# Altium schematic sheet IF.SchDoc: Ararinha 6F
size A4; Revision: 2.0; SheetNumber: 2; SheetTotal: 7
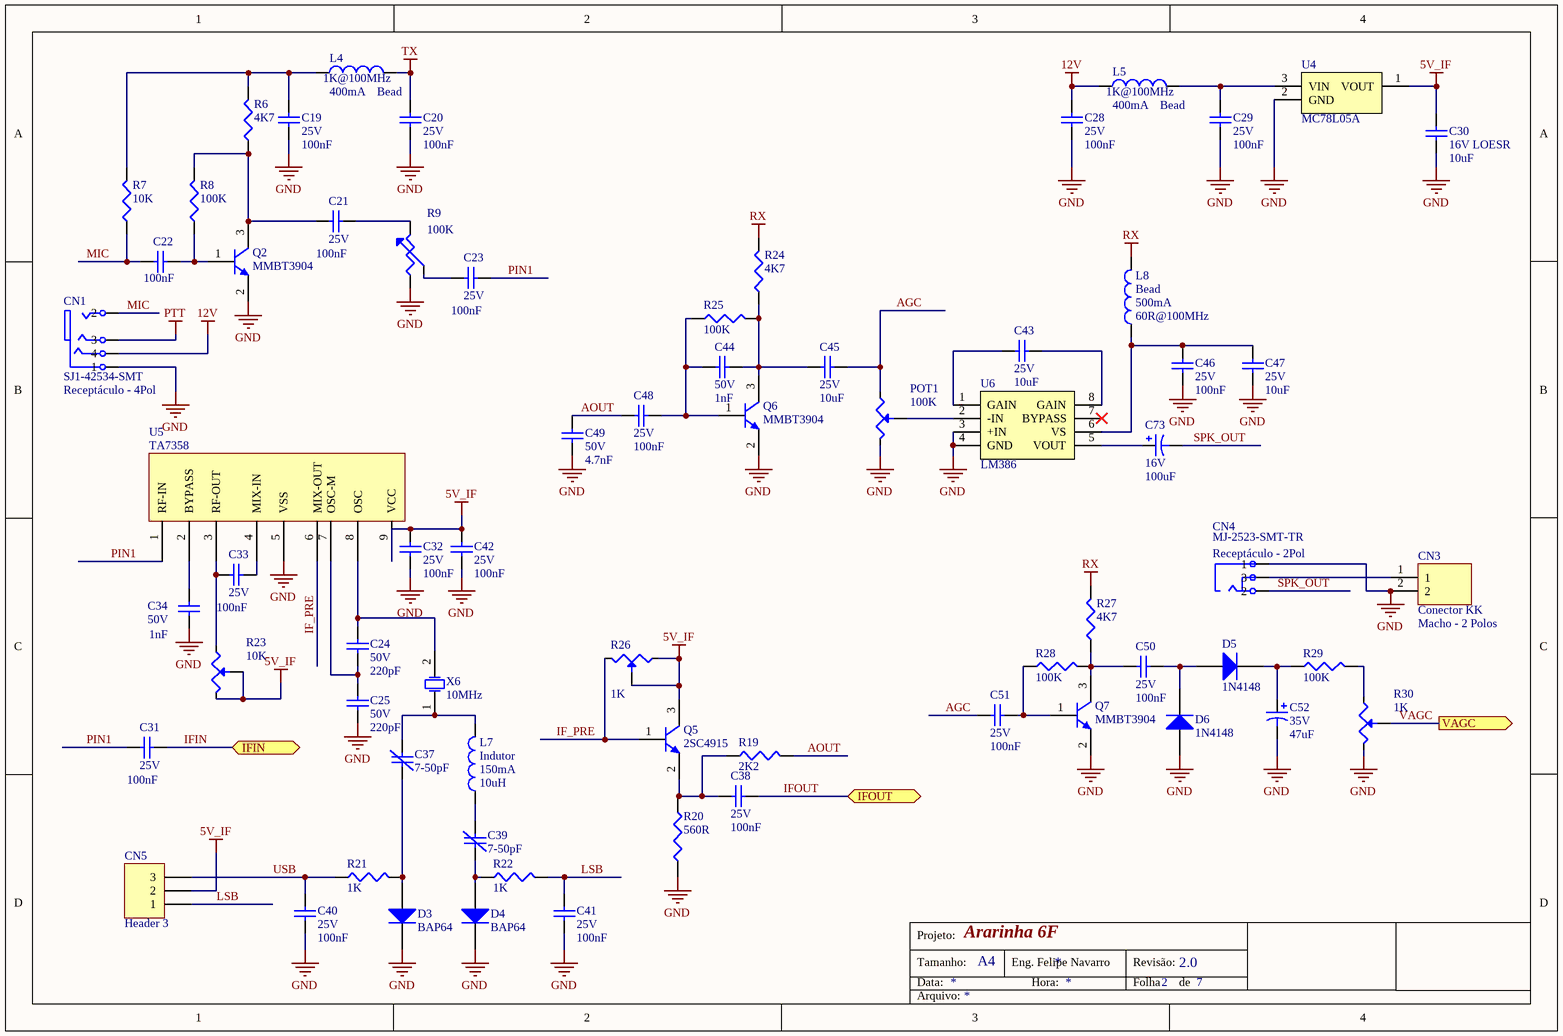
[diagram p0: IF.SchDoc]

## Parts
C19  value 100nF  Tensão: 25V  [CC0603]  (hidden comment: Capacitor Cerâmico)
C20  value 100nF  Tensão: 25V  [CC0603]  (hidden comment: Capacitor Cerâmico)
C21  value 100nF  Tensão: 25V  [CC0603]  (hidden comment: Capacitor Cerâmico)
C22  value 100nF  [CC0603]  (hidden comment: Capacitor Cerâmico)
C23  value 100nF  Tensão: 25V  [CC0603]  (hidden comment: Capacitor Cerâmico)
C24  value 220pF  Tensão: 50V  [CC0603]  (hidden comment: Capacitor Cerâmico)
C25  value 220pF  Tensão: 50V  [CC0603]  (hidden comment: Capacitor Cerâmico)
C28  value 100nF  Tensão: 25V  [CC0603]  (hidden comment: Capacitor Cerâmico)
C29  value 100nF  Tensão: 25V  [CC0603]  (hidden comment: Capacitor Cerâmico)
C30  value 10uF  Tensão: 16V LOESR  [CC0805]  (hidden comment: Capacitor Cerâmico)
C31  value 100nF  Tensão: 25V  [CC0603]  (hidden comment: Capacitor Cerâmico)
C32  value 100nF  Tensão: 25V  [CC0603]  (hidden comment: Capacitor Cerâmico)
C33  value 100nF  Tensão: 25V  [CC0603]  (hidden comment: Capacitor Cerâmico)
C34  value 1nF  Tensão: 50V  [CC0603]  (hidden comment: Capacitor Cerâmico)
C37  value 7-50pF  [MURATA TZB4]  (hidden comment: Trimmer)
C38  value 100nF  Tensão: 25V  [CC0603]  (hidden comment: Capacitor Cerâmico)
C39  value 7-50pF  [MURATA TZB4]  (hidden comment: Trimmer)
C40  value 100nF  Tensão: 25V  [CC0603]  (hidden comment: Capacitor Cerâmico)
C41  value 100nF  Tensão: 25V  [CC0603]  (hidden comment: Capacitor Cerâmico)
C42  value 100nF  Tensão: 25V  [CC0603]  (hidden comment: Capacitor Cerâmico)
C43  value 10uF  Tensão: 25V  [CC0805]  (hidden comment: Capacitor Cerâmico)
C44  value 1nF  Tensão: 50V  [CC0603]  (hidden comment: Capacitor Cerâmico)
C45  value 10uF  Tensão: 25V  [CC0805]  (hidden comment: Capacitor Cerâmico)
C46  value 100nF  Tensão: 25V  [CC0603]  (hidden comment: Capacitor Cerâmico)
C47  value 10uF  Tensão: 25V  [CC0805]  (hidden comment: Capacitor Cerâmico)
C48  value 100nF  Tensão: 25V  [CC0603]  (hidden comment: Capacitor Cerâmico)
C49  value 4.7nF  Tensão: 50V  [CC0603]  (hidden comment: Capacitor Cerâmico)
C50  value 100nF  Tensão: 25V  [CC0603]  (hidden comment: Capacitor Cerâmico)
C51  value 100nF  Tensão: 25V  [CC0603]  (hidden comment: Capacitor Cerâmico)
C52  value 47uF  Tensão: 35V  [CPOLRAD5X11]  (hidden comment: Capacitor Eletrolítico)
C73  value 100uF  Tensão: 16V  [CPOLRAD6X12]  (hidden comment: Capacitor Eletrolítico)
CN1  SJ1-42534-SMT  value Receptáculo - 4Pol  [CONN_JACK-P2_2.5-4N]
CN3  Conector KK  value Macho - 2 Polos  [CONN HDR2-POL P.100]
CN4  MJ-2523-SMT-TR  value Receptáculo - 2Pol  [MJ-2523-SMT-TR]
CN5  Header 3  [CONN HDR1X3]
D3  BAP64  [SOD523]
D4  BAP64  [SOD523]
D5  1N4148  [SOD-323 Diodo-K2]
D6  1N4148  [SOD-323 Diodo-K2]
L4  Bead  value 1K@100MHz  Corrente: 400mA  [CC0603]
L5  Bead  value 1K@100MHz  Corrente: 400mA  [CC0603]
L7  Indutor  value 10uH  Corrente: 150mA  [CC0805]
L8  Bead  value 60R@100MHz  Corrente: 500mA  [CC0603]
POT1  value 100K  [POT - PTV09]  (hidden comment: Potenciômetro)
Q2  MMBT3904  [SOT-23-3N]
Q5  2SC4915  [SOT-23-3N]
Q6  MMBT3904  [SOT-23-3N]
Q7  MMBT3904  [SOT-23-3N]
R6  value 4K7  [CC0603]  (hidden comment: Resistor)
R7  value 10K  [CC0603]  (hidden comment: Resistor)
R8  value 100K  [CC0603]  (hidden comment: Resistor)
R9  value 100K  [POT]  (hidden comment: Potenciômetro)
R19  value 2K2  [CC0603]  (hidden comment: Resistor)
R20  value 560R  [CC0603]  (hidden comment: Resistor)
R21  value 1K  [CC0603]  (hidden comment: Resistor)
R22  value 1K  [CC0603]  (hidden comment: Resistor)
R23  value 10K  [POT]  (hidden comment: Potenciômetro)
R24  value 4K7  [CC0603]  (hidden comment: Resistor)
R25  value 100K  [CC0603]  (hidden comment: Resistor)
R26  value 1K  [POT]  (hidden comment: Potenciômetro)
R27  value 4K7  [CC0603]  (hidden comment: Resistor)
R28  value 100K  [CC0603]  (hidden comment: Resistor)
R29  value 100K  [CC0603]  (hidden comment: Resistor)
R30  value 1K  [POT]  (hidden comment: Potenciômetro)
U4  MC78L05A  [SOT-89-3N]
U5  TA7358  [SIP9]
U6  LM386  [SOIC-8N]
X6  10MHz  [HC/49US]

## Ports
IFIN (bidir), IFOUT (bidir), VAGC (out)

## Nets
5V_IF: C30.2 C32.1 C42.1 CN5.2 Q5.3(C) R23.2(TAP) R23.3 R26.1 R26.2(TAP) U4.1(VOUT) U5.9(VCC)
12V: C28.1 CN1.4 L5.1
GND: C19.2 C20.2 C25.1 C28.2 C29.2 C30.1 C32.2 C34.2 C40.2 C41.2 C42.2 C46.2 C47.1 C49.1 C52.2 CN1.1 CN3.2 CN4.1 D3.2(K) D4.2(K) D6.1(A) POT1.3 Q2.2(E) Q6.2(E) Q7.2(E) R9.2 R20.1 R30.3 U4.2(GND) U5.5(VSS) U6.3(+IN) U6.4(GND)
PTT: CN1.3
RX: L8.2 R24.2 R27.2
TX: C20.1 L4.2
AGC: C45.2 C51.1 POT1.1
AOUT: C48.1 C49.2 R19.2
IF_PRE: Q5.1(B) R26.3 U5.6(MIX-OUT)
IFIN: C31.1 ; port IFIN
IFOUT: C38.2 ; port IFOUT
LSB: C41.1 CN5.1 R22.2
MIC: C22.2 CN1.2 R7.1
PIN1: C23.1 C31.2 U5.1(RF-IN)
SPK_OUT: C73.2 CN4.2
USB: C40.1 CN5.3 R21.1
VAGC: R30.2(TAP) ; port VAGC
NetC19_1: C19.1 L4.1 R6.2 R7.2
NetC21_1: C21.1 R9.1
NetC21_2: C21.2 Q2.3(C) R6.1 R8.2
NetC22_1: C22.1 Q2.1(B) R8.1
NetC23_2: C23.2 R9.3(TAP)
NetC24_1: C24.1 C25.2 U5.7(OSC-M)
NetC24_2: C24.2 U5.8(OSC) X6.2(OSC2)
NetC29_1: C29.1 L5.2 U4.3(VIN)
NetC33_1: C33.1 U5.4(MIX-IN)
NetC33_2: C33.2 R23.1 U5.3(RF-OUT)
NetC34_1: C34.1 U5.2(BYPASS)
NetC37_1: C37.1 D3.1(A) R21.2
NetC37_2: C37.2 L7.2 X6.1(OSC1)
NetC38_1: C38.1 Q5.2(E) R19.1 R20.2
NetC39_1: C39.1 D4.1(A) R22.1
NetC39_2: C39.2 L7.1
NetC43_1: C43.1 U6.1(GAIN)
NetC43_2: C43.2 U6.8(GAIN)
NetC44_1: C44.1 C48.2 Q6.1(B) R25.1
NetC44_2: C44.2 C45.1 Q6.3(C) R24.1 R25.2
NetC46_1: C46.1 C47.2 L8.1 U6.6(VS)
NetC50_1: C50.1 Q7.3(C) R27.1 R28.2
NetC50_2: C50.2 D5.1(A) D6.2(K)
NetC51_2: C51.2 Q7.1(B) R28.1
NetC52_1: C52.1 D5.2(K) R29.1
NetC73_1: C73.1 U6.5(VOUT)
NetCN3_1: CN3.1 CN4.3
NetPOT1_2: POT1.2(TAP) U6.2(-IN)
NetR29_2: R29.2 R30.1

Not connected (* = marked no-connect by the designer): U6 7(BYPASS)*

## Notes on the sheet
- Projeto:
- Tamanho:
- Data:
- A4
- Eng. Felipe Navarro
- Hora:
- Revisão:
- Folha
- de
- Arquivo:

## Library data of the parts
C19-C23 C28 C29 C31-C33 C38 C40-C42 C46 C48 C50 C51 = Cap 100nF 25V 0603 X7R: Capacitor (Semiconductor SIM Model); Chinês: Local; ChinesePrice: 0,00246; Corrente: *A; Potência: *W; Obs:: X7R; Tolerância: ±10%; Supplier 1: Digi-Key; Supplier Part Number 1: 490-1524-1-ND; ComponentLink1Description: Datasheet; ComponentLink1URL: D:\Tecnoclade\Datasheet\!DataMissing.pdf
C24 C25 = Cap 220pF 50V 0603 NP0: Capacitor (Semiconductor SIM Model); Chinês: -----; ChinesePrice: 0,00000; Corrente: *A; Potência: *W; Obs:: NP0; Tolerância: ±5%; Supplier 1: Digi-Key; Supplier Part Number 1: 1276-1048-1-ND; ComponentLink1Description: Datasheet; ComponentLink1URL: D:\Tecnoclade\Datasheet\!DataMissing.pdf
C30 = Cap 10uF 16V 0805 X6S LOESR: Capacitor (Semiconductor SIM Model); Chinês: -----; ChinesePrice: 0,00000; Corrente: *A; Potência: *W; Obs:: X6S - C2012X6S1C106K; Tolerância: ±10%; Supplier 1: Digi-Key; Supplier Part Number 1: 445-7611-1-ND; ComponentLink1Description: Datasheet; ComponentLink1URL: D:\Tecnoclade\Datasheet\!DataMissing.pdf
C34 C44 = Cap 1nF 50V 0603 NP0: Capacitor (Semiconductor SIM Model); Chinês: Local; ChinesePrice: 0,00700; Corrente: *A; Potência: *W; Obs:: NP0; Tolerância: ±5%; Supplier 1: Digi-Key; Supplier Part Number 1: 490-1451-1-ND; ComponentLink1Description: Datasheet; ComponentLink1URL: D:\Tecnoclade\Datasheet\!DataMissing.pdf
C37 C39 = Trimmer 7-50pF 50V TZB4-BB: Capacitor (Semiconductor SIM Model); Chinês: ----; ChinesePrice: 0,00000; Corrente: *A; Potência: *W; Tolerância: ±*%; Tensão: 50V; Supplier 1: Digi-Key; Supplier Part Number 1: 490-1983-1-ND; Obs:: *; ComponentLink1Description: Datasheet; ComponentLink1URL: D:\Tecnoclade\Datasheet\!DataMissing.pdf
C43 C45 C47 = Cap 10uF 25V 0805 X5R: Capacitor (Semiconductor SIM Model); Chinês: Local; ChinesePrice: 0,02620; Corrente: *A; Potência: *W; Obs:: X5R; Tolerância: ±10%; Supplier 1: Digi-Key; Supplier Part Number 1: 587-2985-1-ND; ComponentLink1Description: Datasheet; ComponentLink1URL: D:\Tecnoclade\Datasheet\!DataMissing.pdf
C49 = Cap 4.7nF 50V 0603 X7R: Capacitor (Semiconductor SIM Model); Chinês: -----; ChinesePrice: 0,00000; Corrente: *A; Potência: *W; Obs:: X7R; Tolerância: ±10%; Supplier 1: Digi-Key; Supplier Part Number 1: 490-1506-1-ND; ComponentLink1Description: Datasheet; ComponentLink1URL: D:\Tecnoclade\Datasheet\!DataMissing.pdf
C52 = PCap 47uF 35V 5d.x11h.: Polarized Capacitor (Radial); ChinesePrice: 0,00000; Chinês: ----; Corrente: *A; Potência: *W; Obs: Alumínio (Z=0R22); Tolerância: ±20%; Supplier 1: Digi-Key; Supplier Part Number 1: 1189-1302-ND; ComponentLink1Description: Datasheet; ComponentLink1URL: D:\Tecnoclade\Datasheet\!DataMissing.pdf
C73 = PCap 100uF 16V 5d.x12h.: Polarized Capacitor (Radial); ChinesePrice: 0,00000; Chinês: ----; Corrente: *A; Potência: *W; Obs: Alumínio; Tolerância: ±20%; Supplier 1: Digi-Key; Supplier Part Number 1: 399-6601-ND; ComponentLink1Description: Datasheet; ComponentLink1URL: D:\Tecnoclade\Datasheet\!DataMissing.pdf
CN1 = Jack-4Pol: Jack Socket, SMD Vertical, 4-Conductor Open Circuit; ChinesePrice: 0,00000; Chinês: ----; Corrente: 300mA; Tensão: 16V; Supplier 1: Digi-Key; Potência: *; Obs:: SJ1-42534-SMT; Tolerância: *; ComponentLink1Description: Datasheet; ComponentLink1URL: D:\Tecnoclade\Datasheet\Conector Jack SJ1-42534.pdf; Supplier Part Number 1: CP1-42534SJCT-ND
CN3 = KK 2P Macho-V P2.54mm: ChinesePrice: 0,01400; Chinês: Local; Corrente: *; Potência: *; Supplier 1: Digi-Key; Supplier Part Number 1: A19423-ND; Tensão: *; Obs:: *; Tolerância: *; ComponentLink1Description: Datasheet; ComponentLink1URL: D:\Tecnoclade\Datasheet\!DataMissing.pdf
CN4 = MJ-2523-SMT-TR: CONN AUDIO JACK MONO 2.5MM SMD; ChinesePrice: 0,00000; Chinês: ----; Corrente: 300mA; Obs:: SJ1-42534-SMT; Supplier 1: Digi-Key; Potência: *; Tolerância: *; ComponentLink1Description: Datasheet; ComponentLink1URL: D:\Tecnoclade\Datasheet\Conector Jack SJ1-42534.pdf; Supplier Part Number 1: CP-2523MJCT-ND
CN5 = Header 3: Header, 3-Pin; ChinesePrice: 0,10000; Chinês: Proved - Local; Value: Barra de 40 pinos - ATENÇÃO; Corrente: *; Potência: *; Supplier 1: Digi-Key; Supplier Part Number 1: A26509-40-ND; Tensão: *; Obs:: *; Tolerância: *; ComponentLink1Description: Datasheet; ComponentLink1URL: D:\Tecnoclade\Datasheet\!DataMissing.pdf
D3 D4 = PIN BAP64: PIN DIODE; ChinesePrice: 0,00000; Chinês: ----; Corrente: *; Potência: *; Supplier 1: Digi-Key; Supplier Part Number 1: 568-1929-1-ND; Tensão: *; Value: *; Obs:: *; Tolerância: *; ComponentLink1Description: Datasheet; ComponentLink1URL: D:\Tecnoclade\Datasheet\!DataMissing.pdf
D5 D6 = DP 75V 150mA SOD-323: Small Signal Diodes; ChinesePrice: 0,00000; Chinês: ----; Obs:: Small Signal =< 200mA (Io), Any Speed; Supplier 1: Digi-Key; Supplier Part Number 1: 1N4148WSFSCT-ND; Potência: *; Value: *; Tolerância: *; ComponentLink1Description: Datasheet; ComponentLink1URL: D:\Tecnoclade\Datasheet\!DataMissing.pdf
L4 L5 = Bd 1K@100MHz 0603 400mA: ChinesePrice: 0,00000; Chinês: -----; Obs:: Ferrite (0R5); Tolerância: ±25%; Potência: *; Supplier 1: Digi-Key; Supplier Part Number 1: 445-1550-1-ND; Tensão: *; ComponentLink1Description: Datasheet; ComponentLink1URL: D:\Tecnoclade\Datasheet\!DataMissing.pdf; Substituição: 27/06/2014
L7 = Ind 10uH 0805 150mA: Inductor; ChinesePrice: 0,00000; Chinês: ----; Tolerância: ±10%; Potência: *; Supplier 1: Digi-Key; Supplier Part Number 1: 587-2045-1-ND; Tensão: *; Obs:: *; ComponentLink1Description: Datasheet; ComponentLink1URL: D:\Tecnoclade\Datasheet\!DataMissing.pdf; Substituição: 00/00/0000
L8 = Bd 60R@100MHz 0603 500mA: ChinesePrice: 0,00820; Chinês: Local; Obs:: Ferrite (0R1); Tolerância: ±*%; Potência: *; Supplier 1: Digi-Key; Supplier Part Number 1: 490-1036-1-ND; Tensão: *; Substituição: 22/05/2014; ComponentLink1Description: Datasheet; ComponentLink1URL: D:\Tecnoclade\Datasheet\!DataMissing.pdf
POT1 = POT 100k Audio: Potenciometro; ChinesePrice: 0,00000; Chinês: ----; Corrente: *A; Potência: *W; Tensão: *V; Tolerância: ±*%; Supplier 1: Digi-Key; Supplier Part Number 1: PTV09A-2020F-B104-ND; Obs: *; ComponentLink1Description: Datasheet; ComponentLink1URL: D:\Tecnoclade\Datasheet\!DataMissing.pdf
Q2 Q6 = TRS MMBT3904 40V 200mA SOT-23-3N: NPN General Purpose Amplifier; Tensão: 40V; Corrente: 600mA; Potência: 350mW; Chinês: ----; ChinesePrice: 0,00000; Value: 300MHz; Supplier 1: Digi-Key; Supplier Part Number 1: 568-4510-1-ND; Obs:: *; Tolerância: *; ComponentLink1Description: Datasheet; ComponentLink1URL: D:\Tecnoclade\Datasheet\!DataMissing.pdf
Q5 = TRS 2SC3324 120V 100mA SOT-23-3: NPN General Purpose Amplifier; Tensão: 40V; Corrente: 600mA; Potência: 350mW; Chinês: ----; ChinesePrice: 0,00000; Value: 300MHz; Supplier 1: Digi-Key; Supplier Part Number 1: 2SC4915-OLFCT-ND; Obs:: *; Tolerância: *; ComponentLink1Description: Datasheet; ComponentLink1URL: D:\Tecnoclade\Datasheet\!DataMissing.pdf
Q7 = TRS MMBT2222 40V 200mA SOT-23-3N: NPN General Purpose Amplifier; Tensão: 40V; Corrente: 200mA; Potência: 250mW; Chinês: ----; ChinesePrice: 0,00000; Value: 300MHz; Supplier 1: Digi-Key; Supplier Part Number 1: MMBT2222ATPMSCT-ND; Obs:: *; Tolerância: *; ComponentLink1Description: Datasheet; ComponentLink1URL: D:\Tecnoclade\Datasheet\!DataMissing.pdf
R6 R24 R27 = Res 4K7 1% 0603 1/10W: ChinesePrice: 0,00000; Chinês: ----; Corrente: *A; Potência: 1/10W; Tensão: *V; Obs: ±100ppm/ºC; Tolerância: ±1%; Supplier 1: Digi-Key; Supplier Part Number 1: RMCF0603FT4K70CT-ND; ComponentLink1Description: Datasheet; ComponentLink1URL: D:\Tecnoclade\Datasheet\!DataMissing.pdf
R7 = Res 10K 1% 0603 1/10W: ChinesePrice: 0,00089; Chinês: Local; Corrente: *A; Potência: 1/10W; Tensão: *V; Tolerância: ±1%; Supplier 1: Digi-Key; Supplier Part Number 1: P10.0KHCT-ND; Obs: *; ComponentLink1Description: Datasheet; ComponentLink1URL: D:\Tecnoclade\Datasheet\!DataMissing.pdf
R8 R25 R28 R29 = Res 100K 1% 0603 1/10W: ChinesePrice: 0,00089; Chinês: Local; Corrente: *A; Potência: 1/10W; Tensão: *V; Tolerância: ±1%; Supplier 1: Digi-Key; Supplier Part Number 1: P100KHCT-ND; Obs: *; ComponentLink1Description: Datasheet; ComponentLink1URL: D:\Tecnoclade\Datasheet\!DataMissing.pdf
R9 = Res Trim: Trimmer; ChinesePrice: 0,00000; Chinês: ----; Corrente: *A; Potência: *W; Tensão: *V; Tolerância: ±*%; Supplier 1: Digi-Key; Supplier Part Number 1: 490-2876-ND; Obs: *; ComponentLink1Description: Datasheet; ComponentLink1URL: D:\Tecnoclade\Datasheet\!DataMissing.pdf
R19 = Res 2K2 5% 0603 1/10W: ChinesePrice: 0,00000; Chinês: ----; Corrente: *A; Potência: 1/10W; Tensão: *V; Obs: ±200ºC/ppm; Tolerância: ±5%; Supplier 1: Digi-Key; Supplier Part Number 1: RMCF0603JT2K20CT-ND; ComponentLink1Description: Datasheet; ComponentLink1URL: D:\Tecnoclade\Datasheet\!DataMissing.pdf
R20 = Res 560R 1% 0603 1/10w: ChinesePrice: 0,00000; Chinês: ----; Corrente: *A; Potência: 1/10W; Tensão: *V; Tolerância: ±*%; Supplier 1: Digi-Key; Supplier Part Number 1: 311-560HRCT-ND; Obs:: *; ComponentLink1Description: Datasheet; ComponentLink1URL: D:\Tecnoclade\Datasheet\!DataMissing.pdf
R21 R22 = Res 1K 1% 0603 1/10W: ChinesePrice: 0,00089; Chinês: Local; Corrente: *A; Potência: 1/10W; Tensão: *V; Tolerância: ±1%; Supplier 1: Digi-Key; Supplier Part Number 1: RMCF0603FT1K00CT-ND; Obs: *; ComponentLink1Description: Datasheet; ComponentLink1URL: D:\Tecnoclade\Datasheet\!DataMissing.pdf
R23 R26 R30 = Res Pot: Potenciometro; ChinesePrice: 0,00000; Chinês: ----; Corrente: *A; Potência: *W; Tensão: *V; Tolerância: ±*%; Supplier 1: Digi-Key; Supplier Part Number 1: --Del; Obs: *; ComponentLink1Description: Datasheet; ComponentLink1URL: D:\Tecnoclade\Datasheet\!DataMissing.pdf
U4 = MC78L05: Regulador Linear 5V; Chinês: -----; Corrente: 100mA; ChinesePrice: 0,00000; Potência: *; Value: *; Supplier 1: Digi-Key; Supplier Part Number 1: MC78L05ACHXCT-ND; Tensão: 5V; Obs:: *; Tolerância: *; ComponentLink1Description: Datasheet; ComponentLink1URL: D:\Tecnoclade\Datasheet\
U5 = TA7358: FM FRONT-END; ChinesePrice: 0,00000; Chinês: ----; Corrente: *; Potência: *; Tensão: *; Value: *; Supplier 1: Digi-Key; Obs:: *; Tolerância: *; ComponentLink1Description: Datasheet; ComponentLink1URL: D:\Tecnoclade\Datasheet\
U6 = LM386: IC AMP AUDIO PWR .325W AB 8SOIC; ChinesePrice: 1,94000; Chinês: Local; Value: Memória; Corrente: *; Potência: *; Supplier 1: Digi-Key; Supplier Part Number 1: LM386MX-1/NOPBCT-ND; Tensão: *; Obs:: *; Tolerância: *; ComponentLink1Description: Datasheet; ComponentLink1URL: D:\Tecnoclade\Datasheet\!DataMissing.pdf
X6 = XTAL: Crystal Oscillator; ChinesePrice: 0,00000; Chinês: ----; Value: 20pF/40R; Corrente: *; Potência: *; Supplier 1: Digi-Key; Supplier Part Number 1: --Del; Tensão: *; Obs:: *; Tolerância: *